# Altium schematic sheet 05_04_Bufif_and_Notif.SchDoc
size 142 x 66 mm
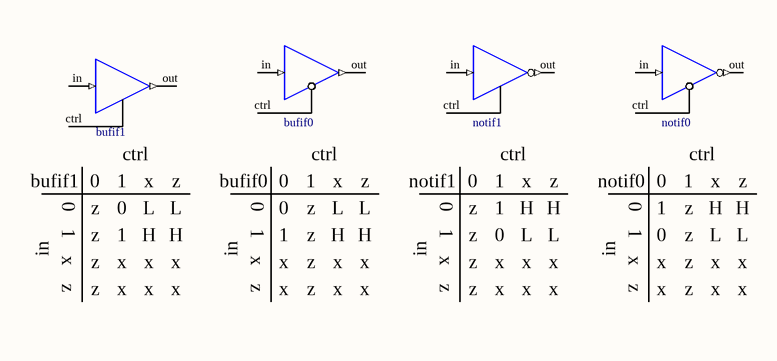
[diagram p0: 05_04_Bufif_and_Notif.SchDoc]

## Parts
U17  bufif0
U18  notif1
U19  notif0
U20  bufif1

## Nets

Not connected (* = marked no-connect by the designer): U17 ctrl in out; U18 ctrl in out; U19 ctrl in out; U20 ctrl in out

## Notes on the sheet
- (near U20) bufif1
- (near U20) 0
- (near U20) 1
- (near U20) ctrl
- (near U20) x
- (near U20) z
- bufif0
- 0
- 1
- (near U17) ctrl
- x
- z
- notif1
- (near U18) ctrl
- notif0
- (near U19) ctrl
- in
- L
- H